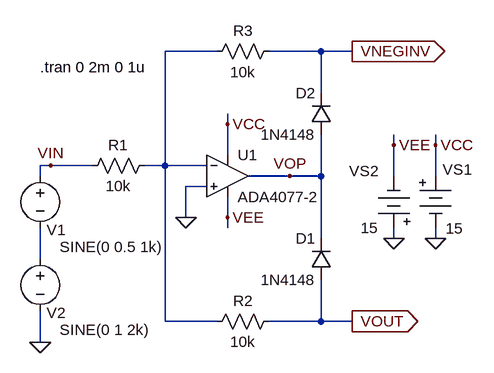
[diagram p0: schematic fig-01-03-13.asc]
fig-01-03-13.asc, the LTspice schematic file:
Version 4
SHEET 1 880 680
WIRE 192 -16 112 -16
WIRE 352 -16 272 -16
WIRE 400 -16 352 -16
WIRE 352 48 352 -16
WIRE 208 96 208 80
WIRE 464 128 464 112
WIRE 528 128 528 112
WIRE 208 144 208 96
WIRE -64 160 -80 160
WIRE 0 160 -64 160
WIRE 112 160 112 -16
WIRE 112 160 80 160
WIRE 176 160 112 160
WIRE -80 176 -80 160
WIRE 304 176 240 176
WIRE 352 176 352 112
WIRE 352 176 304 176
WIRE 464 176 464 128
WIRE 528 176 528 128
WIRE 176 192 144 192
WIRE 144 240 144 192
WIRE 208 240 208 208
WIRE 208 256 208 240
WIRE 352 272 352 176
WIRE 464 272 464 256
WIRE 528 272 528 256
WIRE -80 304 -80 256
WIRE 112 400 112 160
WIRE 192 400 112 400
WIRE 352 400 352 336
WIRE 352 400 272 400
WIRE 400 400 352 400
WIRE -80 432 -80 384
FLAG -80 432 0
FLAG 400 400 VOUT
IOPIN 400 400 Out
FLAG -64 160 VIN
FLAG 464 272 0
FLAG 528 272 0
FLAG 464 128 VEE
FLAG 528 128 VCC
FLAG 208 96 VCC
FLAG 208 240 VEE
FLAG 144 240 0
FLAG 400 -16 VNEGINV
IOPIN 400 -16 Out
FLAG 304 176 VOP
SYMBOL voltage -80 160 R0
WINDOW 0 10 99 Left 2
WINDOW 3 30 125 Left 2
WINDOW 123 0 0 Left 0
WINDOW 39 0 0 Left 0
SYMATTR InstName V1
SYMATTR Value SINE(0 0.5 1k)
SYMBOL diode 368 112 R180
WINDOW 0 24 64 Left 2
WINDOW 3 24 0 Left 2
SYMATTR InstName D2
SYMATTR Value 1N4148
SYMBOL Misc\\battery 528 160 R0
WINDOW 0 11 6 Left 2
WINDOW 3 16 97 Left 2
SYMATTR InstName VS1
SYMATTR Value 15
SYMBOL Misc\\battery 464 272 R180
WINDOW 0 24 104 Left 2
WINDOW 3 24 16 Left 2
SYMATTR InstName VS2
SYMATTR Value 15
SYMBOL diode 368 336 R180
WINDOW 0 24 64 Left 2
WINDOW 3 24 0 Left 2
SYMATTR InstName D1
SYMATTR Value 1N4148
SYMBOL res 96 144 R90
WINDOW 0 0 56 VBottom 2
WINDOW 3 32 56 VTop 2
SYMATTR InstName R1
SYMATTR Value 10k
SYMBOL res 288 -32 R90
WINDOW 0 0 56 VBottom 2
WINDOW 3 32 56 VTop 2
SYMATTR InstName R3
SYMATTR Value 10k
SYMBOL res 288 384 R90
WINDOW 0 0 56 VBottom 2
WINDOW 3 32 56 VTop 2
SYMATTR InstName R2
SYMATTR Value 10k
SYMBOL voltage -80 288 R0
WINDOW 0 10 99 Left 2
WINDOW 3 30 125 Left 2
WINDOW 123 0 0 Left 0
WINDOW 39 0 0 Left 0
SYMATTR InstName V2
SYMATTR Value SINE(0 1 2k)
SYMBOL Opamps\\ADA4077-2 208 112 R0
SYMATTR InstName U1
TEXT -80 8 Left 2 !.tran 0 2m 0 1u

The netlist it stands for:
* fig-01-03-13.asc
V1 VIN N002 SINE(0 0.5 1k)
D2 VOP VNEGINV 1N4148
VS1 VCC 0 15
VS2 0 VEE 15
D1 VOUT VOP 1N4148
R1 N001 VIN 10k
R3 VNEGINV N001 10k
R2 VOUT N001 10k
V2 N002 0 SINE(0 1 2k)
XU1 0 N001 VCC VEE VOP ADA4077-2  ; pins In+ In- V+ V- OUT
.model D D
.lib standard.dio
.tran 0 2m 0 1u
.backanno
.end